# EAGLE design Word Clock (EAGLE 7.2.0)
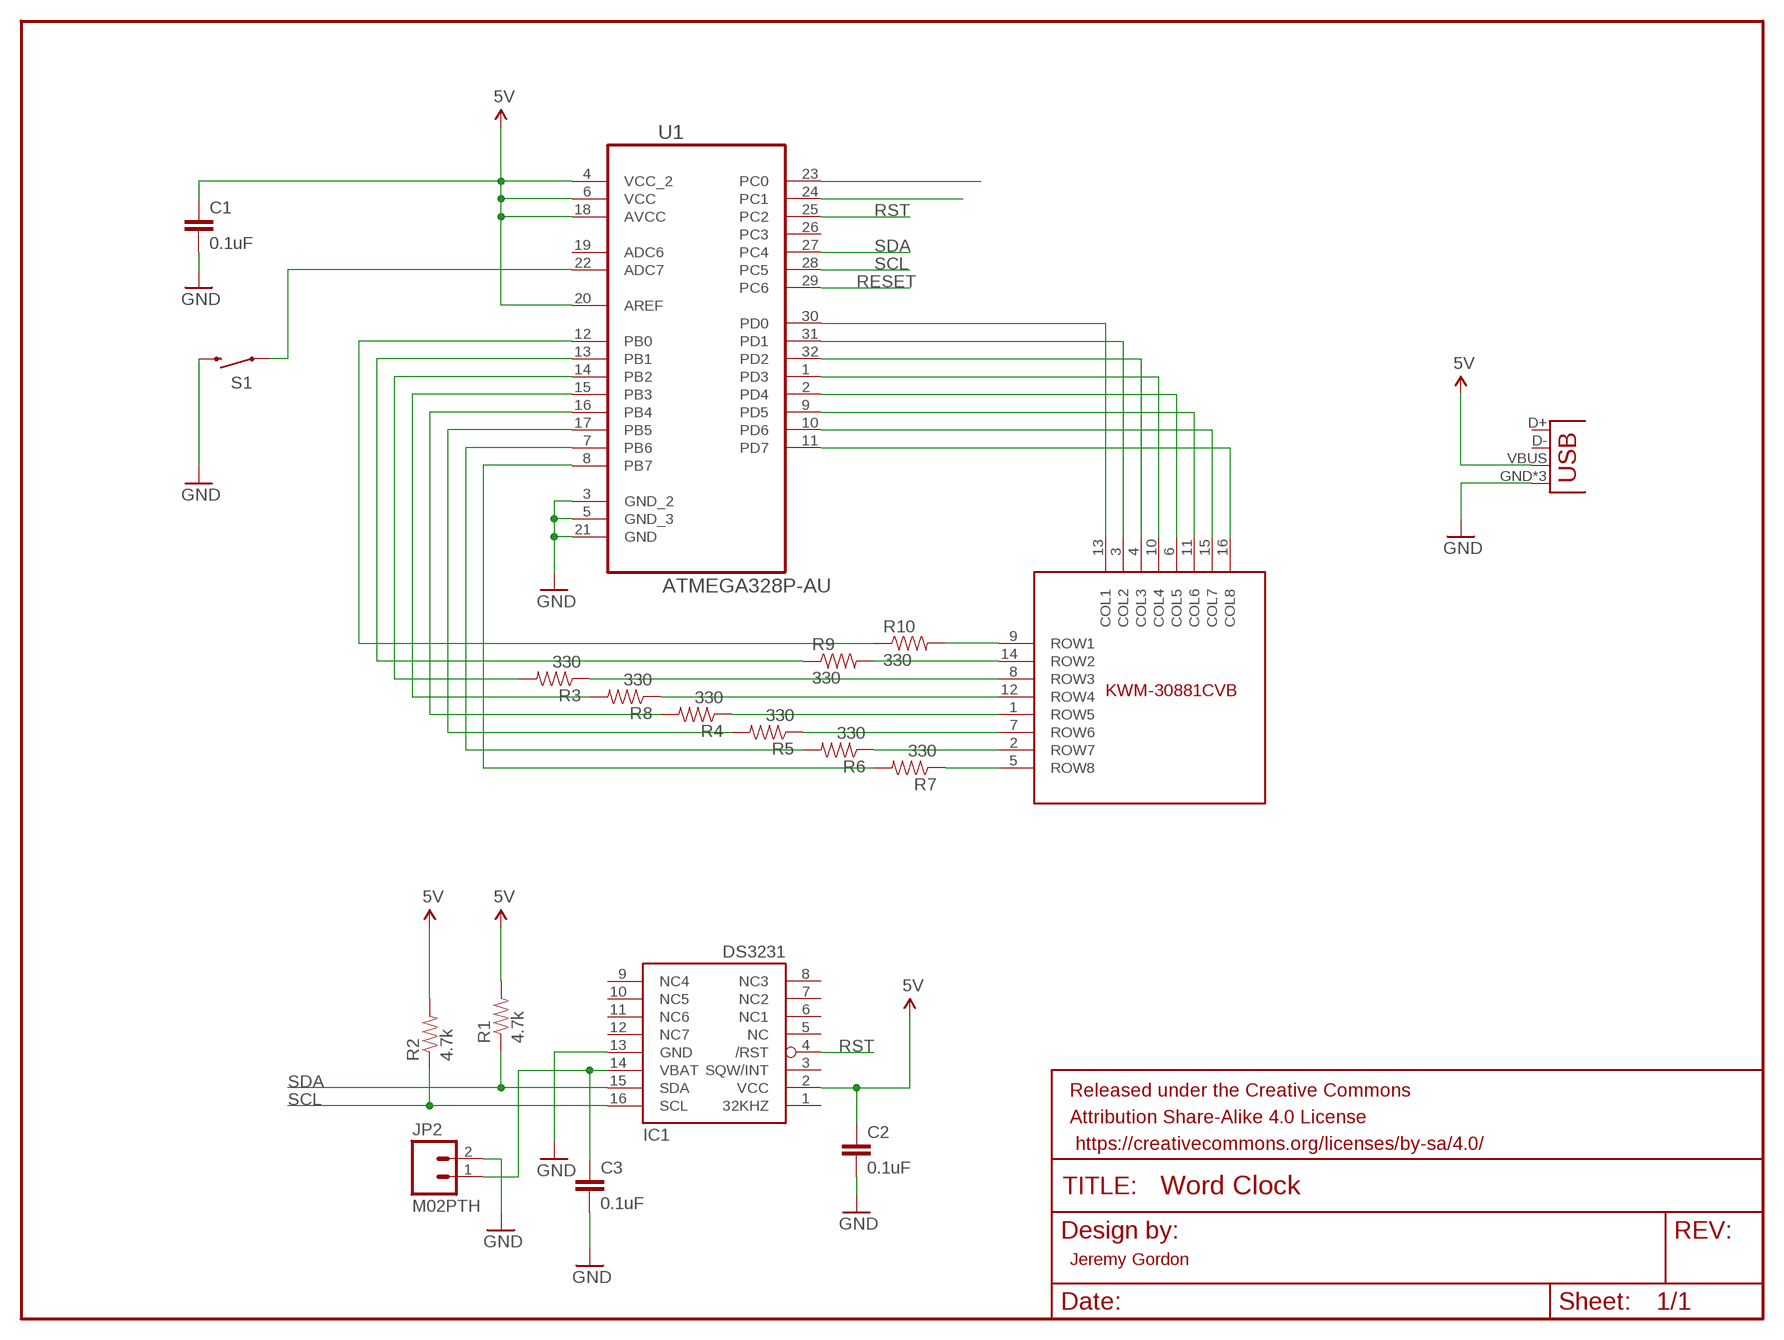
[diagram p0: schematic, sheet 1]

## Parts
C1  0.1uF  CAP0805  [0805]
C2  0.1uF  CAP0805  [0805]
C3  0.1uF  CAP0805  [0805]
D1  KWM-30881CVB  [KWM-30881CVB]
FRAME1  FRAME-LETTER  [CREATIVE_COMMONS]
IC1  DS3231/SO  [SO16W]
JP1  USB-MICROB  [USB-MICROB]
JP2  M02PTH  [1X02]
R1  4.7k  RESISTOR0805-RES  [0805]
R2  4.7k  RESISTOR0805-RES  [0805]
R3  330  RESISTOR0805-RES  [0805]
R4  330  RESISTOR0805-RES  [0805]
R5  330  RESISTOR0805-RES  [0805]
R6  330  RESISTOR0805-RES  [0805]
R7  330  RESISTOR0805-RES  [0805]
R8  330  RESISTOR0805-RES  [0805]
R9  330  RESISTOR0805-RES  [0805]
R10  330  RESISTOR0805-RES  [0805]
S1  SWITCH-MOMENTARY-2SMD-1101NE  [TACTILE-SWITCH-1101NE]
U1  ATMEGA328P-AU  [QFP80P900X900X120-32N]

## Nets
5V: C1.1 C2.1 IC1.2(VCC) JP1.VBUS R1.2 R2.2 U1.4(VCC_2) U1.6(VCC) U1.18(AVCC) U1.20(AREF)
GND: C1.2 C2.2 C3.2 IC1.13(GND) JP1.GND JP1.MT1(GND) JP1.MT2(GND) JP2.2 S1.2 U1.3(GND_2) U1.5(GND_3) U1.21(GND)
N$1: D1.13(COL1) U1.30(PD0)
N$2: D1.3(COL2) U1.31(PD1)
N$3: D1.4(COL3) U1.32(PD2)
N$4: D1.10(COL4) U1.1(PD3)
N$5: D1.6(COL5) U1.2(PD4)
N$6: D1.11(COL6) U1.9(PD5)
N$7: D1.15(COL7) U1.10(PD6)
N$8: D1.16(COL8) U1.11(PD7)
N$9: U1.24(PC1)
N$10: U1.23(PC0)
N$11: R9.1 U1.13(PB1)
N$12: R8.2 U1.15(PB3)
N$13: R4.2 U1.16(PB4)
N$14: R5.2 U1.17(PB5)
N$15: R10.1 U1.12(PB0)
N$17: C3.1 IC1.14(VBAT) JP2.1
N$18: S1.1 U1.22(ADC7)
N$19: D1.8(ROW3) R3.1
N$20: D1.12(ROW4) R8.1
N$21: D1.1(ROW5) R4.1
N$22: D1.7(ROW6) R5.1
N$23: D1.2(ROW7) R6.1
N$24: D1.5(ROW8) R7.1
N$25: D1.9(ROW1) R10.2
N$26: D1.14(ROW2) R9.2
N$30: R6.2 U1.7(PB6)
N$31: R7.2 U1.8(PB7)
N$33: R3.2 U1.14(PB2)
RESET: U1.29(PC6)
RST: IC1.4(/RST) U1.25(PC2)
SCL: IC1.16(SCL) R2.1 U1.28(PC5)
SDA: IC1.15(SDA) R1.1 U1.27(PC4)
Unconnected: IC1.1(32KHZ) IC1.3(SQW/INT) IC1.5(NC) IC1.6(NC1) IC1.7(NC2) IC1.8(NC3) IC1.9(NC4) IC1.10(NC5) IC1.11(NC6) IC1.12(NC7) JP1.D+ JP1.D- U1.19(ADC6) U1.26(PC3)

## Notes on the sheet
- Jeremy Gordon

## Library data of the parts
C1-C3 = SparkFun-Capacitors:CAP: Capacitor Standard 0603 ceramic capacitor, and 0.1" leaded capacitor.
D1 = KWM-30881XVB:KWM-30881CVB
FRAME1 = SparkFun-Aesthetics:FRAME-LETTER: Schematic Frame Standard 8.5x11 US Letter frame
IC1 = adafruit:DS3231
JP1 = SparkFun-Connectors:USB: USB Connectors USB-B-PTH is fully proven SKU : PRT-00139/CONN-08278 USB-miniB is fully proven SKU : PRT-00587 USB-A-PCB is untested. USB-A-H is throughly reviewed, but untested. Spark Fun Electronics SKU : PRT-00437 USB-B-SMT is throughly reviewed, but untested. Needs silkscreen touching up. USB-A-S has not been used/tested USB-MB-H has not been used/tested USB-MICROB has been used. CONN-09505; PROD_ID: CONN-09505
JP2 = SparkFun-Connectors:M02: Standard 2-pin 0.1" header. Use with - straight break away headers ( PRT-00116) - right angle break away headers (PRT-00553) - swiss pins (PRT-00743) - machine pins (PRT-00117) - female headers (PRT-00115) Molex polarized connector foot print use with: PRT-08233 with associated crimp pins and housings. 2.54_SCREWTERM for use with PRT-10571. 3.5mm Screw Terminal footprints for PRT-08084 5mm Screw Terminal footprints for use with PRT-08432
R1-R10 = SparkFun-Resistors:RESISTOR: Resistor Basic schematic elements and footprints for 0603, 1206, and PTH resistors.
S1 = SparkFun-Electromechanical:SWITCH-MOMENTARY-2: Various NO switches- pushbuttons, reed, etc; PROD_ID: SWCH-00815
U1 = Atmel_By_element14_Batch_1-00:ATMEGA328P-AU: 8-bit Microcontroller with In-System Programmable Flash; MPN: ATMEGA328P-AU; OC_FARNELL: 1715486; OC_NEWARK: 14R4631; PACKAGE: TQFP-32; SUPPLIER: Atmel

## Board
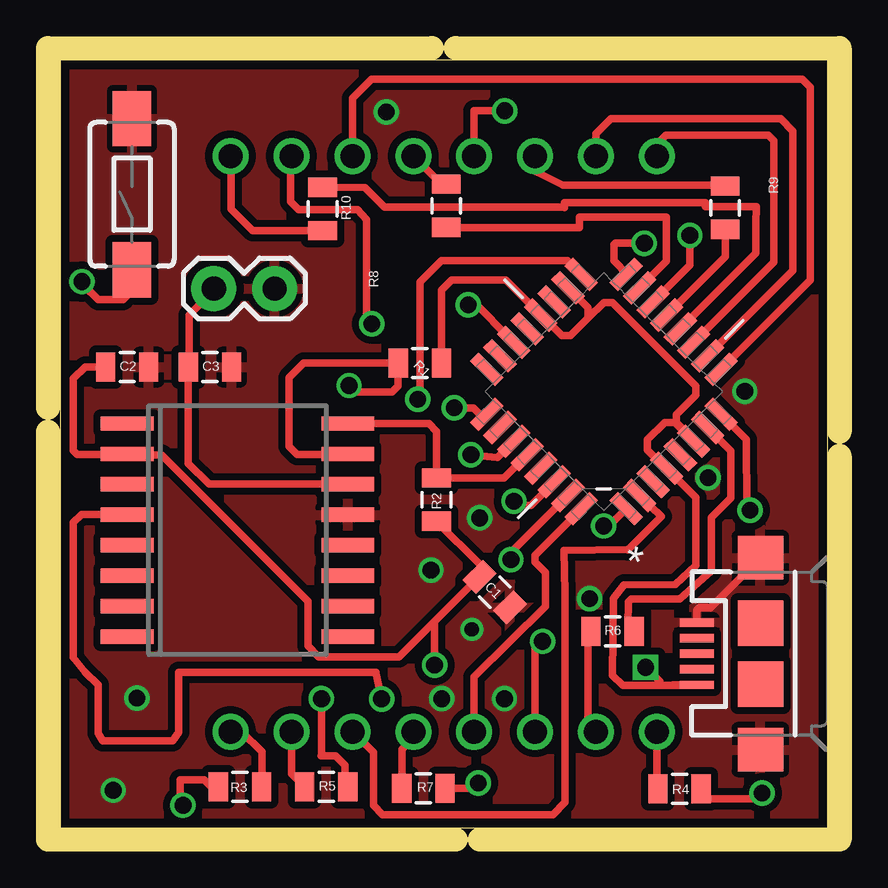
[diagram p1: board, top side]
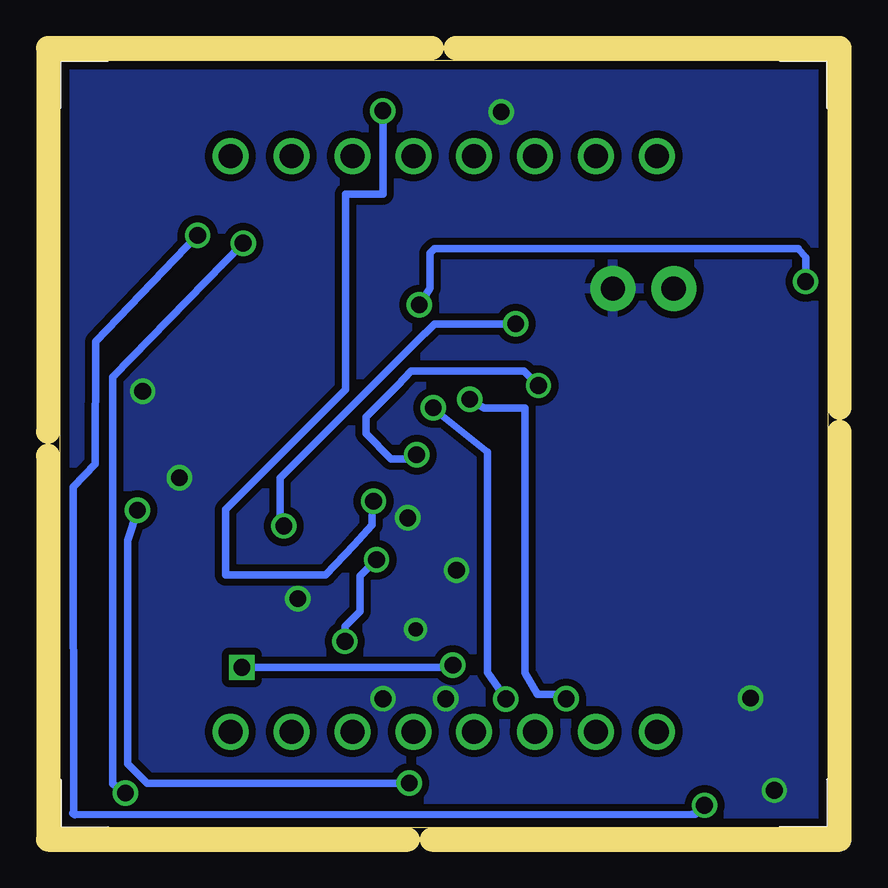
[diagram p2: board, bottom side, seen from below]

Size 32 x 32 mm. Coordinates in mm from the lower left corner, seen from the top.
Outline: 0,0 32,0 32,32 0,32 0,0
Copper layers (1*16): Top 0.0356mm / dielectric 1.5011mm / Bottom 0.0356mm
Design rules "LaenPCBOrder *": minimum track width 6mil, minimum drill 13mil, track to track 0.2mm, track to pad 0.2mm, pad to pad 0.2mm, via to via 0.2mm, smd to smd 0.2mm, copper to edge 15mil, drill to drill 6mil, minimum pad ring 7mil, minimum via ring 7mil, stop-mask expansion 3mil, vias tented up to drill 0mil, thermal gap 10mil
Milling: 8 lines

### Footprints (pad centres in the part's own frame; a part is rotated, then mirrored left to right if it is on the bottom)
0805 = smd 0.8 x 1.2: 1 -0.9,0; 2 0.9,0
KWM-30881CVB = drill 1: 1 -8.89,-12; 2 -6.35,-12; 3 -3.81,-12; 4 -1.27,-12; 5 1.27,-12; 6 3.81,-12; 7 6.35,-12; 8 8.89,-12; 9 8.89,12; 10 6.35,12; 11 3.81,12; 12 1.27,12; 13 -1.27,12; 14 -3.81,12; 15 -6.35,12; 16 -8.89,12
SO16W = smd 0.6 x 2.2: 1 -4.445,-4.6; 2 -3.175,-4.6; 3 -1.905,-4.6; 4 -0.635,-4.6; 5 0.635,-4.6; 6 1.905,-4.6; 7 3.175,-4.6; 8 4.445,-4.6; 9 4.445,4.6; 10 3.175,4.6; 11 1.905,4.6; 12 0.635,4.6; 13 -0.635,4.6; 14 -1.905,4.6; 15 -3.175,4.6; 16 -4.445,4.6
USB-MICROB = smd 0.35 x 1.4: D+ 0,2.65; D- -0.65,2.65; GND 1.3,2.65; ID 0.65,2.65; VBUS -1.3,2.65 | smd 1.8 x 1.9: MT1 -4,0; MT2 4,0 | smd 1.9 x 1.9: P$1 -1.27,0; P$2 1.27,0
1X02 = drill 1.016 pad 1.88: 1 0,0; 2 2.54,0
TACTILE-SWITCH-1101NE = smd 2.3 x 1.6: 1 -3.15,0; 2 3.15,0
QFP80P900X900X120-32N = smd 1.473 x 0.508: 1 -4.115,2.794; 2 -4.115,2.007; 3 -4.115,1.194; 4 -4.115,0.406; 5 -4.115,-0.406; 6 -4.115,-1.194; 7 -4.115,-2.007; 8 -4.115,-2.794; 17 4.115,-2.794; 18 4.115,-2.007; 19 4.115,-1.194; 20 4.115,-0.406; 21 4.115,0.406; 22 4.115,1.194; 23 4.115,2.007; 24 4.115,2.794 | smd 0.508 x 1.473: 9 -2.794,-4.115; 10 -2.007,-4.115; 11 -1.194,-4.115; 12 -0.406,-4.115; 13 0.406,-4.115; 14 1.194,-4.115; 15 2.007,-4.115; 16 2.794,-4.115; 25 2.794,4.115; 26 2.007,4.115; 27 1.194,4.115; 28 0.406,4.115; 29 -0.406,4.115; 30 -1.194,4.115; 31 -2.007,4.115; 32 -2.794,4.115

### Placement (x,y rotation side)
C1  18.13,9.82 315 top
C2  2.8,19.2 0 top
C3  6.25,19.2 0 top
D1  16,16 0 bottom
FRAME1  -14.47,-12.39 0 top  (outside the outline)
IC1  7.4,12.4 270 top
JP1  29.2,7.25 90 top
JP2  6.41,22.47 0 top
R1  15,19.36 0 top
R2  15.7,13.67 270 top
R3  7.5,1.7 180 top
R4  25.83,1.61 0 top
R5  11.1,1.7 0 top
R6  23.04,8.18 0 top
R7  15.15,1.64 0 top
R8  16.1,25.92 270 top
R9  27.73,25.84 90 top
R10  10.95,25.79 270 top
S1  3,26.4 90 top
U1  22.67,18.17 135 top

### Tracks (layer width: path | path; a pad name or v marks a point on that pad's centre or on a via)
5V  (via drill 0.7)
  Top 0.305: U1.18 22.01,21.67 22.01,21.23 | 22.01,21.23 21.29,20.51 20.92,20.51 20.06,21.37 U1.20 18.59,22.82 16.32,22.82 15.9,22.4 R1.2 | 22.01,21.23 22.67,21.89 23.04,21.89 26.52,18.41 26.52,18.03 25.7,17.21 25.7,16.89 26.42,16.17 U1.6 25.64,16.89 25.21,16.89 24.49,16.17 24.49,15.74 25.26,14.97 U1.4 26.5,13.77 26.5,10.92 25.65,10.14 23.51,10.12 23.07,9.56 23.04,6.35 23.46,5.93 25,5.93 | C2.1 1.05,19.2 0.56,18.71 0.56,15.72 0.72,15.56 2.79,15.56 IC1.2 2.85,15.53 4.23,15.53 10.34,9.42 10.34,7.57 10.79,7.12 14.14,7.12 15.62,8.6 | 17.51,10.49 C1.1 | 25.54,5.93 25.56,5.95 JP1.VBUS 26.53,5.93 25,5.93 | R2.2 17.51,10.96 17.51,10.49 | 17.51,10.49 15.62,8.6 | 15.62,8.6 v15.62,6.77 | v24.42,6.68 25,6.1 25,5.93
  Bottom 0.305: v15.62,6.77 15.71,6.68 v24.42,6.68
GND  (via drill 0.6, 0.7)
  Top 0.305: JP1.GND 26.55,9.07 26.64,9.16 27.11,9.16 JP1.MT2
  other vias: 27.02,14.58 28.55,18.19 15.47,10.73 17.17,8.26 3.21,5.4 17.5,12.91 22.08,9.54 18.53,5.37 15.92,5.37 2.22,1.55 13.6,29.83
  pour Top (isolate 0.3): 0,32 0,0 32,0 32,32
  pour Bottom (isolate 0.3): 0,32 32,32 32,0 0,0
N$1  (via drill 0.7)
  Top 0.305: v18.93,13.6 19.1,13.43 19.63,13.43 20.61,14.4 U1.30 | v18.54,29.88 17.27,29.88 D1.13
  Bottom 0.305: v18.93,13.6 18.96,13.53 18.98,12.61 19.74,11.78 20.92,10.53 25.1,10.53 25.1,13.27 20.1,18.27 20.1,26.4 18.87,26.4 18.54,26.4 v18.54,29.88
N$2  (via drill 0.7)
  Top 0.305: U1.31 18.82,11.48 v18.8,11.17 | v20.12,7.76 19.81,7.45 D1.3
  Bottom 0.305: v18.8,11.17 19.49,10.48 19.49,9.02 20.12,8.39 v20.12,7.76
N$3
  Top 0.305: U1.32 19.8,11.35 19.8,11.07 20.24,10.63 20.24,9.22 17.27,6.28 D1.4
N$4  (via drill 0.7)
  Top 0.305: 9.6,27.95 D1.10 9.62,27.97 9.62,26.09 9.94,25.77 12.4,25.77 12.79,25.35 12.79,21.21 v13,21 | v22.67,12.57 22.79,12.47 U1.1
  Bottom 0.305: v13,21 16.39,21 16.79,20.6 16.81,20.6 22.83,14.58 22.83,12.35 v22.67,12.57
N$5
  Top 0.305: U1.2 25.08,12.97 23.67,11.57 23.66,11.59 21.01,11.56 21.06,9.81 21.06,1.05 20.55,0.54 13.45,0.54 13.07,0.92 13.07,3.13 D1.6
N$6
  Top 0.305: U1.9 31.28,22.83 31.28,30.86 30.95,31.19 12.98,31.19 12.19,30.4 D1.11
N$7
  Top 0.305: U1.10 30.56,23.22 30.56,29.04 30.05,29.55 22.97,29.55 22.35,28.93 D1.15
N$8
  Top 0.305: U1.11 29.77,23.58 29.77,28.64 29.54,28.87 25.26,28.87 24.89,28.5 D1.16
N$11
  Top 0.305: U1.13 27.74,23.8 R9.1
N$12
  Top 0.305: U1.15 25.29,23.61 25.29,24.55 25.29,25.2 25.29,25.37 25.29,25.44 21.65,25.44 21.65,25.2 21.66,25.02 18.67,25.02 | 18.68,25.02 18.67,25.02 | 18.67,25.02 R8.2
N$13  (via drill 0.7)
  Top 0.305: U1.16 23.66,23.05 23.09,23.63 23.09,24.3 23.16,24.37 v24.36,24.36 | R4.2 27.1,1.19 29.02,1.19 v29.27,1.44
  Bottom 0.305: v24.36,24.36 29.81,18.78 29.81,1.82 v29.27,1.44
N$14  (via drill 0.7)
  Top 0.305: U1.17 21.15,23.64 15.9,23.64 15,22.74 15.01,18.22 v14.92,17.85 | R5.2 11.88,1.82 11.88,2.59 11.48,2.99 10.88,2.99 10.9,3.01 v10.9,5.37
  Bottom 0.305: v14.92,17.85 14.33,17.5 12.61,17.48 12.61,6.45 12.1,5.56 11.34,5.56 v10.9,5.37
N$15
  Top 0.305: U1.12 29.02,23.95 29.02,25.16 29.03,25.88 26.9,25.88 26.9,26.06 21.03,26.05 21.03,25.85 21.02,25.86 16.2,25.86 13.54,25.86 12.71,26.68 R10.1
N$17
  Top 0.305: IC1.14 11.98,14.32 6.21,14.32 5.35,15.18 C3.1 5.39,19.24 5.39,21.37 6.41,22.39 JP2.1
N$18  (via drill 0.7)
  Top 0.305: U1.22 17.17,21.98 v17.02,21.79 | v0.92,22.76 1.26,22.33 1.28,22.33 1.6,22.01 2.64,22.01 3,22.37 S1.1
  Bottom 0.305: v17.02,21.79 16.58,22.49 16.58,23.94 16.39,24.13 1.21,24.13 0.91,23.76 v0.92,22.76
N$19
  Top 0.305: R3.1 8.43,1.73 8.43,3.15 7.58,4 D1.8
N$20
  Top 0.305: D1.12 15.91,26.82 R8.1
N$21
  Top 0.305: R4.1 24.89,1.65 D1.1
N$22
  Top 0.305: R5.1 9.65,2.25 D1.7
N$23
  Top 0.305: R6.1 22,8.04 22,4 D1.2
N$24
  Top 0.305: R7.1 14.26,3.27 14.73,3.74 D1.5
N$25
  Top 0.305: D1.9 7.14,27.97 7.14,25.79 8.04,24.89 R10.2
N$26
  Top 0.305: R9.2 27.26,26.79 20.96,26.79 19.81,27.36 D1.14
N$30
  Top 0.305: U1.7 27.97,15.71 27.97,13.74 27.15,12.92 27.15,10.7 25.84,9.53 23.82,9.53 23.7,9.41 23.67,8.45 R6.2
N$31  (via drill 0.7)
  Top 0.305: U1.8 28.62,16.17 28.64,13.31 28.84,13.25 v28.77,13.23 | v17.44,1.85 17.23,1.64 R7.2
  Bottom 0.305: v28.77,13.23 29.18,11.96 29.18,2.66 28.37,1.85 v17.44,1.85
N$33  (via drill 0.7)
  Top 0.305: U1.14 26.26,23.45 v26.26,24.69 | v5.13,0.93 5,1 5,2 6,2 6.3,1.7 R3.2
  Bottom 0.305: v26.26,24.69 30.51,20.26 30.53,15.16 31.44,14.19 31.43,0.67 31.44,0.57 31.46,0.6 31.39,0.54 5.66,0.55 5.51,0.55 v5.13,0.93
RST  (via drill 0.7)
  Top 0.305: IC1.4 2.77,13.06 0.91,13.06 0.56,12.71 0.56,7.1 1.06,6.47 1.59,5.94 1.59,3.93 1.78,3.62 4.69,3.62 4.94,3.96 4.94,6.47 13.17,6.47 13.17,6.42 v13.41,5.36 13.66,5.6 | U1.25 17.49,17.24 17.23,17.5 v16.44,17.5
  Bottom 0.305: v16.44,17.5 16.45,17.47 14.18,15.66 14.18,6.47 v13.41,5.36
SCL
  Top 0.305: U1.28 18.51,14.58 R2.1 15.7,16.52 15.38,16.84 IC1.16
SDA  (via drill 0.7)
  Top 0.305: IC1.15 11.98,15.56 9.88,15.56 9.55,15.89 9.55,18.76 10.15,19.36 R1.1 14.1,18.41 13.84,18.15 12.33,18.15 v12.05,18.43 | v17.13,15.54 18.23,15.42 U1.27
  Bottom 0.305: v12.05,18.43 12.66,19.04 17.37,19.04 17.93,18.43 19.24,17.12 19.24,16.42 18.19,15.37 17.26,15.37 v17.13,15.54